# EAGLE design LPC2148 Engine Room ADUM (EAGLE 6.2)
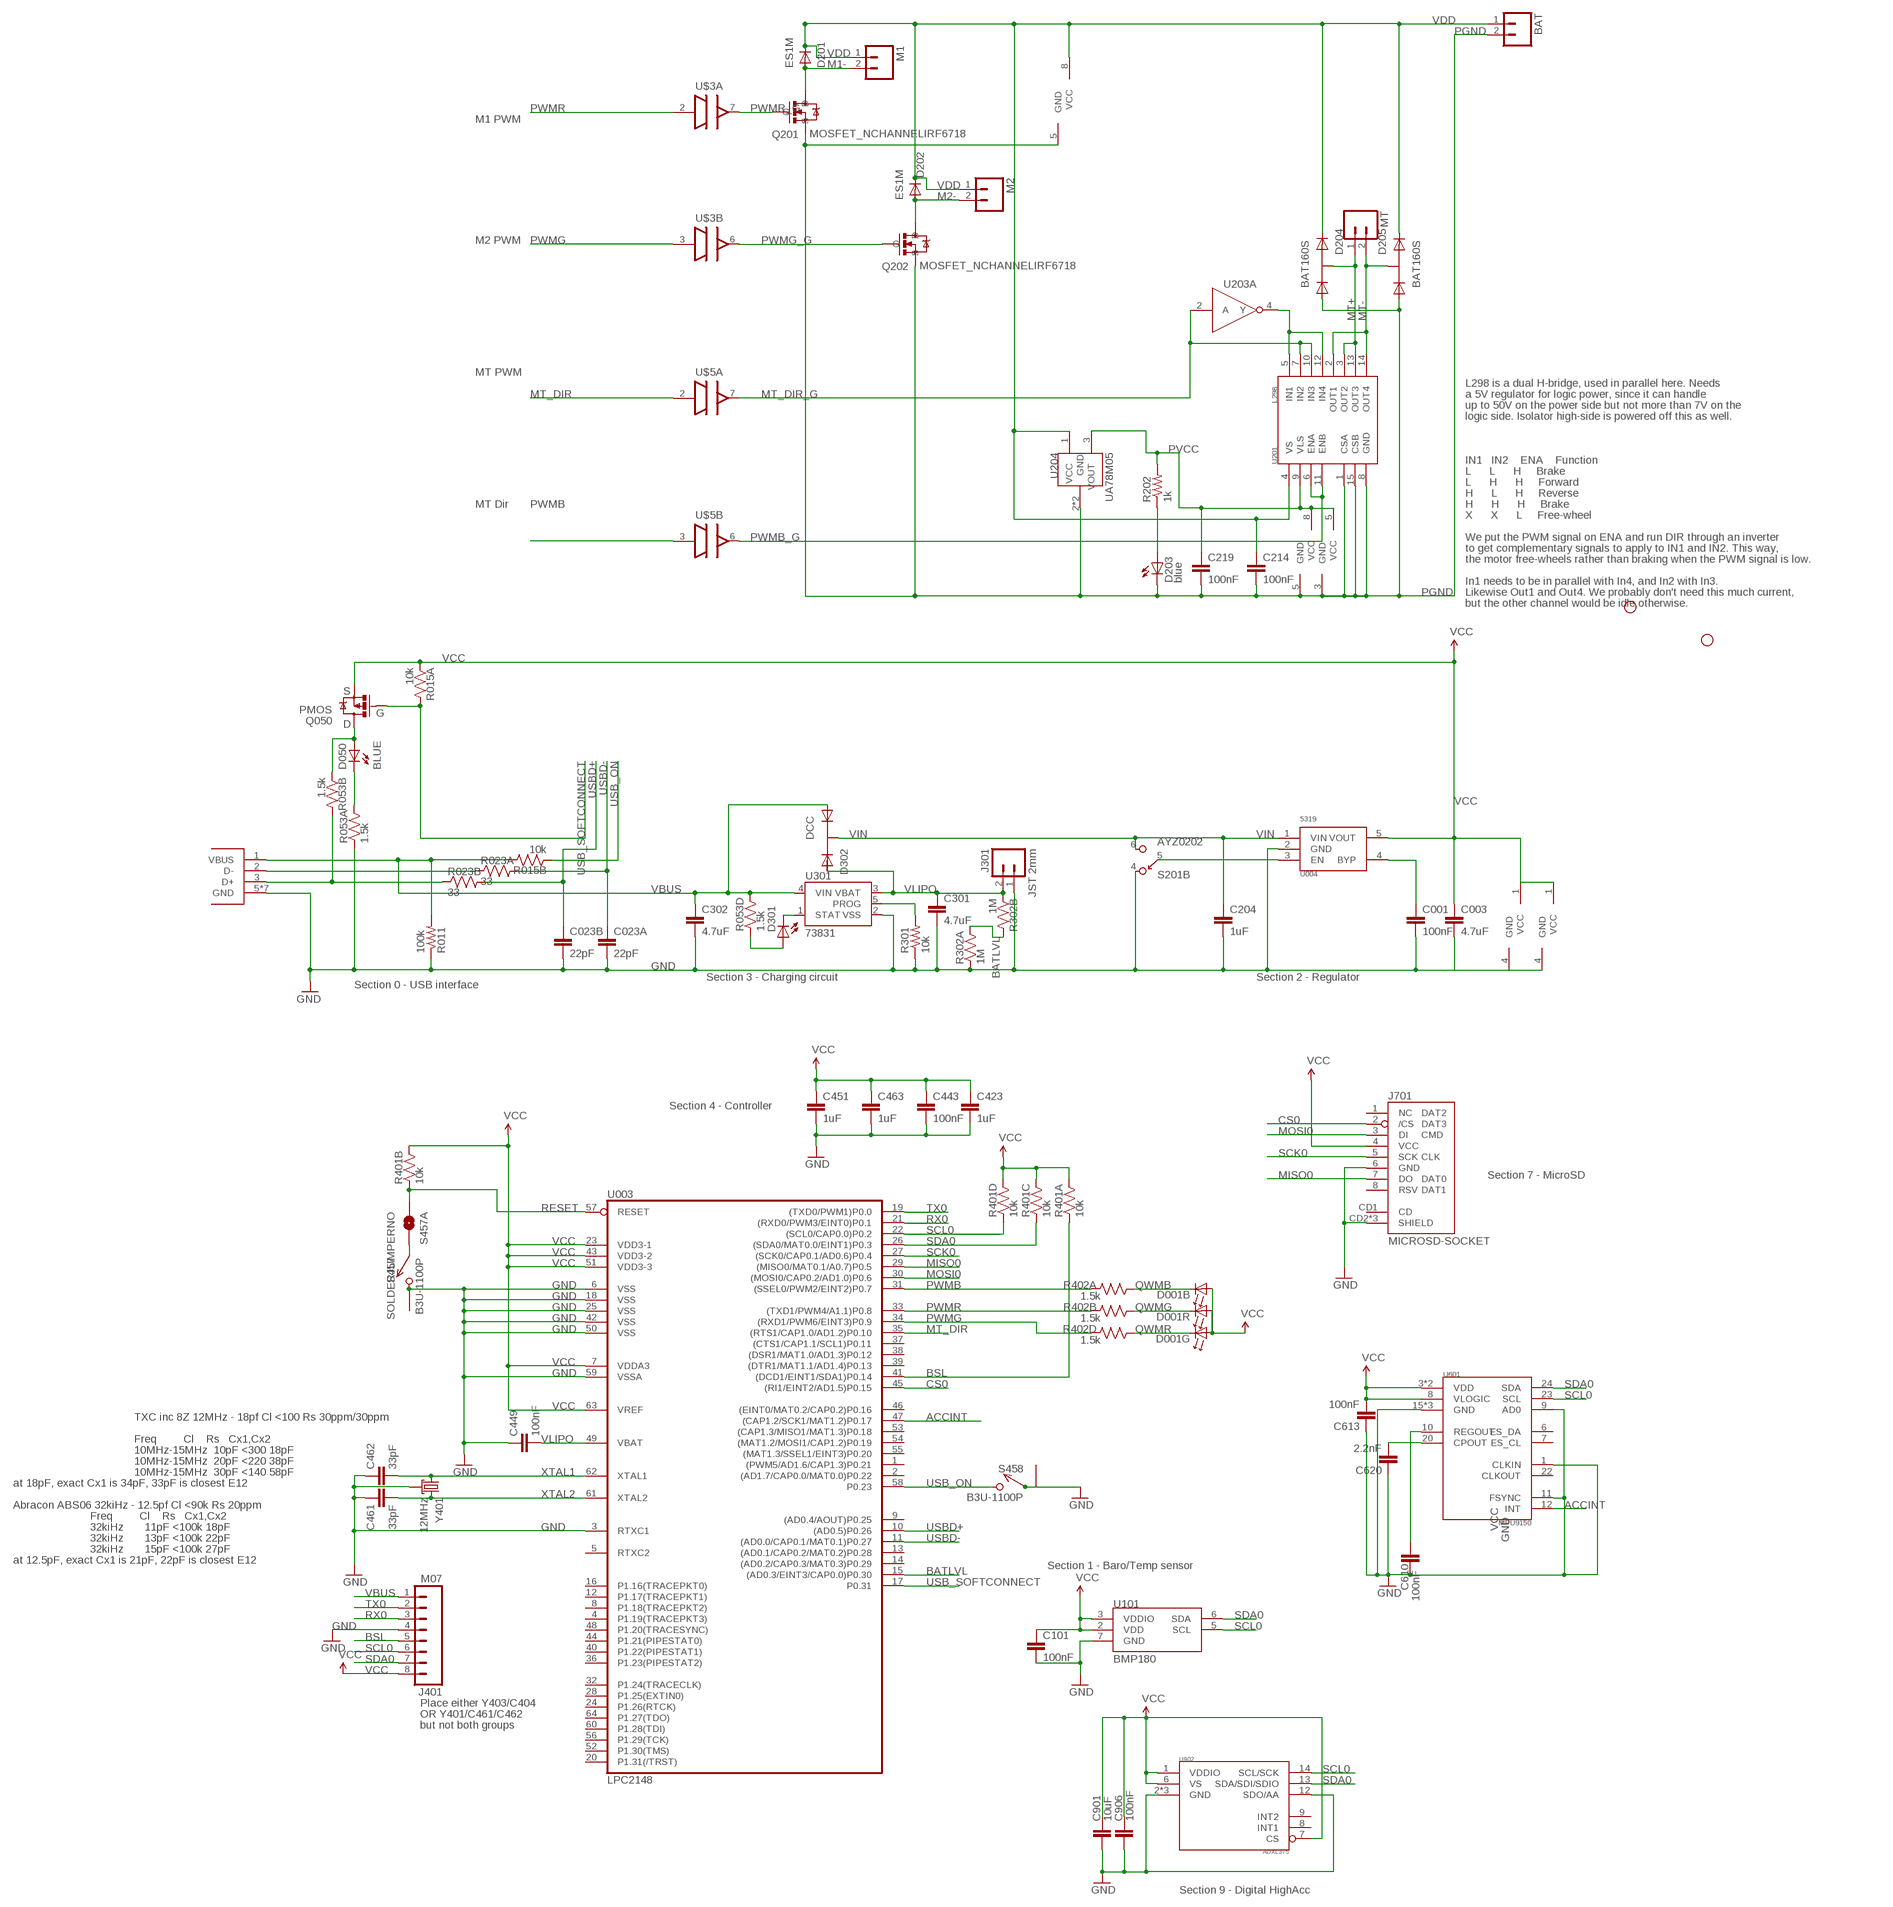
[diagram p0: schematic, sheet 1]

## Parts
BAT  M02PTH4  [1X02_XTRA_BIG]
C001  100nF  CAP0402-CAP  [0402-CAP]
C003  4.7uF  CAP0402-CAP  [0402-CAP]
C023  22pF  CKCM25  [CKCM25]
C101  100nF  CAP0402-CAP  [0402-CAP]
C204  1uF  CAP0402-CAP  [0402-CAP]
C214  100nF  CAP0402-CAP  [0402-CAP]
C219  100nF  CAP0402-CAP  [0402-CAP]
C301  4.7uF  CAP0402-CAP  [0402-CAP]
C302  4.7uF  CAP0402-CAP  [0402-CAP]
C423  1uF  CAP0402-CAP  [0402-CAP]
C443  100nF  CAP0402-CAP  [0402-CAP]
C449  100nF  CAP0402-CAP  [0402-CAP]
C451  1uF  CAP0402-CAP  [0402-CAP]
C461  33pF  CAP0402-CAP  [0402-CAP]
C462  33pF  CAP0402-CAP  [0402-CAP]
C463  1uF  CAP0402-CAP  [0402-CAP]
C610  100nF  CAP0402-CAP  [0402-CAP]
C613  100nF  CAP0402-CAP  [0402-CAP]
C620  2.2nF  CAP0402-CAP  [0402-CAP]
C901  10uF  CAP0603-CAP  [0603-CAP]
C906  100nF  CAP0402-CAP  [0402-CAP]
D001  SMLP36RGB2W(R)  [SMLP36]
D050  BLUE  LED0603  [LED-0603]
D201  ES1M  DIODE-DO-214AC  [DO-214AC]
D202  ES1M  DIODE-DO-214AC  [DO-214AC]
D203  blue  LED0603  [LED-0603]
D204  BAT160S  [SOT-223]
D205  BAT160S  [SOT-223]
D301  YELLOW  LED0603  [LED-0603]
D302  DCC  PMEG2005CT  [SOT-23-3]
J004  USB_MICROB_JSTGCT  [USB_MICROB_3075]
J301  JST 2mm  M02-JST-2MM-SMT  [JST-2-SMD]
J401  M07  M081X08  [1X08]
J701  MICROSD-SOCKET  [MICROSD-SOCKET-PP]
JP1  STAND-OFF  [STAND-OFF]
JP2  STAND-OFF  [STAND-OFF]
M1  M02PTH4  [1X02_XTRA_BIG]
M2  M02PTH4  [1X02_XTRA_BIG]
MT  M02PTH  [1X02]
Q050  PMOS  MOSFET-PCHANNELSMD  [SOT23-3]
Q201  MOSFET_NCHANNELIRF6718  [DIRECTFET_L6]
Q202  MOSFET_NCHANNELIRF6718  [DIRECTFET_L6]
R011  100k  RESISTOR0402-RES  [0402-RES]
R015  10k  RP2EXB24V  [CRA02]
R023  33  RP2EXB24V  [CRA02]
R053  1.5k  RP404  [CRA04]
R202  1k  RESISTOR0402-RES  [0402-RES]
R301  10k  RESISTOR0402-RES  [0402-RES]
R302  1M  RP2EXB24V  [CRA02]
R401  10k  RP404  [CRA04]
R402  1.5k  RP404  [CRA04]
S201  AYZ0202  [AYZ0202]
S457  B3U-1100P  [B3U-1100P]
S457A  SOLDERJUMPERNO  [SJ_2S-NO]
S458  B3U-1100P  [B3U-1100P]
U003  LPC2148  LPC213X  [SQFP-S-10X10-64]
U004  5319  MIC5319D5  [SOT-23-5]
U101  BMP180  [BMP180]
U201  L298  [MULTIWATT15]
U203  MC74VHC1G04  [SOT-23-5]
U204  UA78M05  [SOT-223]
U301  73831  MCP73831  [SOT23-5]
U601  MPU9150  [LLGA24]
U902  ADXL375  [ADXL375]
U$3  ADUM3221  [SO8N]
U$5  ADUM3221  [SO8N]
Y401  12MHz  CX2520  [CRYSTAL_SMD_2MM_2_5MM]

## Nets
ACCINT: U003.47((CAP1.2/SCK1/MAT1.2)P0.17) U601.12(INT)
BATLVL: R302.3 R302.4 U003.15((AD0.3/EINT3/CAP0.0)P0.30)
BSL: J401.5 R401.1 U003.41((DCD1/EINT1/SDA1)P0.14)
CONN_D+: J004.3(D+) R023.2 R053.7
CONN_D-: J004.2(D-) R023.1
CS0: J701.2(/CS) U003.45((RI1/EINT2/AD1.5)P0.15)
EN: S201.5 U004.3(EN)
GND [power]: C001.2 C003.2 C023.3 C023.4 C101.2 C204.2 C301.2 C302.2 C423.2 C443.2 C449.1 C451.2 C461.1 C462.1 C463.2 C610.2 C613.1 C620.1 C901.2 C906.2 J004.5(GND) J004.P$1(GND) J004.P$2(GND) J004.P$3(GND) J004.P$4(GND) J004.P$8(GND) J004.P$10(GND) J301.1 J401.4 J701.6(GND) J701.CD2(SHIELD) J701.GND1(SHIELD) J701.GND3(SHIELD) R011.1 R053.1 R301.1 R302.1 S201.4 S457.P$2 S457.P$3 S458.P$1 S458.P$3 U003.3(RTXC1) U003.6(VSS) U003.18(VSS) U003.25(VSS) U003.42(VSS) U003.50(VSS) U003.59(VSSA) U004.2(GND) U101.7(GND) U301.2(VSS) U601.1(CLKIN) U601.9(AD0) U601.11(FSYNC) U601.15(GND) U601.17(GND) U601.18(GND) U902.2(GND) U902.4(GND) U902.5(GND) U902.12(SDO/AA) U$3.4(INP:GND) U$5.4(INP:GND) Y401.2(GND) Y401.4(GND)
M1- [power]: D201.A M1.2 Q201.D1(D) Q201.D2(D)
M2- [power]: D202.A M2.2 Q202.D1(D) Q202.D2(D)
MISO0: J701.7(DO) U003.29((MISO0/MAT0.1/A0.7)P0.5)
MOSI0: J701.3(DI) U003.30((MOSI0/CAP0.2/AD1.0)P0.6)
MT+ [lt_power]: D204.4(K1A2) MT.1 U201.3(OUT2) U201.13(OUT3)
MT- [lt_power]: D205.4(K1A2) MT.2 U201.2(OUT1) U201.14(OUT4)
MT_DIR: U003.35((RTS1/CAP1.0/AD1.2)P0.10) U$5.2(A:IN)
MT_DIR_G: U201.7(IN2) U201.10(IN3) U203.2(A:A) U$5.7(A:OUT)
N$1: D203.A R202.1
N$2: U201.5(IN1) U201.12(IN4) U203.4(A:Y)
N$12: C620.2 U601.20(CPOUT)
N$13: C610.1 U601.10(REGOUT)
N$14 [power]: S457.P$1 S457A.2
N$15: R301.2 U301.5(PROG)
N$16: D050.C R053.8
N$17: C001.1 U004.4(BYP)
N$18: D301.A R053.4
N$19: D301.C U301.1(STAT)
N$20: D050.A Q050.3(D) R053.2
PGND [power]: BAT.2 C214.2 C219.2 D203.C D204.1(A1) D205.1(A1) Q201.S Q202.S U201.1(CSA) U201.8(GND) U201.15(CSB) U203.3(PWR:GND) U204.2(GND) U204.4(GND) U$3.5(OUTP:GND) U$5.5(OUTP:GND)
PVCC: C219.1 R202.2 U201.9(VLS) U203.5(PWR:VCC) U204.3(VOUT) U$5.8(OUTP:VCC)
PWMB: R402.8 U003.31((SSEL0/PWM2/EINT2)P0.7) U$5.3(B:IN)
PWMB_G: U201.6(ENA) U201.11(ENB) U$5.6(B:OUT)
PWMG: R402.5 U003.34((RXD1/PWM6/EINT3)P0.9) U$3.3(B:IN)
PWMG_G: Q202.G U$3.6(B:OUT)
PWMR: R402.7 U003.33((TXD1/PWM4/A1.1)P0.8) U$3.2(A:IN)
PWMR_G: Q201.G U$3.7(A:OUT)
QWMB: D001.1(B:C) R402.1
QWMG: D001.5(G:C) R402.4
QWMR: D001.3(R:C) R402.2
RESET: R401.2 S457A.1 U003.57(RESET)
RX0: J401.3 U003.21((RXD0/PWM3/EINT0)P0.1)
SCK0: J701.5(SCK) U003.27((SCK0/CAP0.1/AD0.6)P0.4)
SCL0: J401.6 R401.4 U003.22((SCL0/CAP0.0)P0.2) U101.5(SCL) U601.23(SCL) U902.14(SCL/SCK)
SDA0: J401.7 R401.3 U003.26((SDA0/MAT0.0/EINT1)P0.3) U101.6(SDA) U601.24(SDA) U902.13(SDA/SDI/SDIO)
TX0: J401.2 U003.19((TXD0/PWM1)P0.0)
USB_ON: R015.2 S458.P$2 U003.58(P0.23)
USB_SOFTCONNECT: Q050.1(G) R015.4 U003.17(P0.31)
USBD+: C023.2 R023.3 U003.10((AD0.5)P0.26)
USBD-: C023.1 R023.4 U003.11((AD0.0/CAP0.1/MAT0.1)P0.27)
VBUS [power]: C302.1 D302.1(A1) J004.1(VBUS) J401.1 R011.2 R015.3 R053.5 U301.4(VIN)
VCC [power]: C003.1 C101.1 C423.1 C443.1 C451.1 C463.1 C613.2 C901.1 C906.1 D001.2(B:A) D001.4(R:A) D001.6(G:A) J401.8 J701.4(VCC) Q050.2(S) R015.1 R401.5 R401.6 R401.7 R401.8 U003.7(VDDA3) U003.23(VDD3-1) U003.43(VDD3-2) U003.51(VDD3-3) U003.63(VREF) U004.5(VOUT) U101.2(VDD) U101.3(VDDIO) U601.3(VDD) U601.8(VLOGIC) U601.13(VDD) U902.1(VDDIO) U902.6(VS) U902.7(CS) U$3.1(INP:VCC) U$5.1(INP:VCC)
VDD [power]: BAT.1 C214.1 D201.C D202.C D204.3(K2) D205.3(K2) M1.1 M2.1 U201.4(VS) U204.1(VCC) U$3.8(OUTP:VCC)
VIN: C204.1 D302.3(K) S201.6 U004.1(VIN)
VLIPO [power]: C301.1 C449.2 D302.2(A2) J301.2 R302.2 U003.49(VBAT) U301.3(VBAT)
XTAL1: C462.2 U003.62(XTAL1) Y401.1
XTAL2: C461.2 U003.61(XTAL2) Y401.3
Unconnected: J701.1(NC) J701.8(RSV) J701.CD1(CD) R053.3 R053.6 R402.3 R402.6 S201.1 S201.2 S201.3 U003.1((PWM5/AD1.6/CAP1.3)P0.21) U003.2((AD1.7/CAP0.0/MAT0.0)P0.22) U003.4(P1.19(TRACEPKT3)) U003.5(RTXC2) U003.8(P1.18(TRACEPKT2)) U003.9((AD0.4/AOUT)P0.25) U003.12(P1.17(TRACEPKT1)) U003.13((AD0.1/CAP0.2/MAT0.2)P0.28) U003.14((AD0.2/CAP0.3/MAT0.3)P0.29) U003.16(P1.16(TRACEPKT0)) U003.20(P1.31(/TRST)) U003.24(P1.26(RTCK)) U003.28(P1.25(EXTIN0)) U003.32(P1.24(TRACECLK)) U003.36(P1.23(PIPESTAT2)) U003.37((CTS1/CAP1.1/SCL1)P0.11) U003.38((DSR1/MAT1.0/AD1.3)P0.12) U003.39((DTR1/MAT1.1/AD1.4)P0.13) U003.40(P1.22(PIPESTAT1)) U003.44(P1.21(PIPESTAT0)) U003.46((EINT0/MAT0.2/CAP0.2)P0.16) U003.48(P1.20(TRACESYNC)) U003.52(P1.30(TMS)) U003.53((CAP1.3/MISO1/MAT1.3)P0.18) U003.54((MAT1.2/MOSI1/CAP1.2)P0.19) U003.55((MAT1.3/SSEL1/EINT3)P0.20) U003.56(P1.29(TCK)) U003.60(P1.28(TDI)) U003.64(P1.27(TDO)) U601.6(ES_DA) U601.7(ES_CL) U601.22(CLKOUT) U902.8(INT1) U902.9(INT2)

## Notes on the sheet
- M1 PWM
- M2 PWM
- MT PWM
- L298 is a dual H-bridge, used in parallel here. Needs
- a 5V regulator for logic power, since it can handle
- up to 50V on the power side but not more than 7V on the
- logic side. Isolator high-side is powered off this as well.
- IN1   IN2    ENA    Function
- L      L      H     Brake
- L      H      H     Forward
- H      L      H     Reverse
- MT Dir | H      H      H     Brake
- X      X      L     Free-wheel
- We put the PWM signal on ENA and run DIR through an inverter
- to get complementary signals to apply to IN1 and IN2. This way,
- the motor free-wheels rather than braking when the PWM signal is low.
- In1 needs to be in parallel with In4, and In2 with In3.
- Likewise Out1 and Out4. We probably don't need this much current,
- but the other channel would be idle otherwise.
- S
- G
- D
- Section 0 - USB interface | Section 3 - Charging circuit | Section 2 - Regulator
- Section 4 - Controller
- Section 7 - MicroSD
- TXC inc 8Z 12MHz - 18pf Cl <100 Rs 30ppm/30ppm
- Freq         Cl    Rs   Cx1,Cx2
- 10MHz-15MHz  10pF <300 18pF
- 10MHz-15MHz  20pF <220 38pF
- 10MHz-15MHz  30pF <140 58pF
- at 18pF, exact Cx1 is 34pF, 33pF is closest E12
- Abracon ABS06 32kiHz - 12.5pf Cl <90k Rs 20ppm
- Freq         Cl    Rs   Cx1,Cx2
- 32kiHz       11pF <100k 18pF
- 32kiHz       13pF <100k 22pF
- 32kiHz       15pF <100k 27pF
- at 12.5pF, exact Cx1 is 21pF, 22pF is closest E12
- Section 1 - Baro/Temp sensor
- Place either Y403/C404
- OR Y401/C461/C462
- but not both groups
- Section 9 - Digital HighAcc

## Library data of the parts
BAT M1 M2 MT = SparkFun:M02: Header 2 Standard 2-pin 0.1" header. Use with straight break away headers (SKU : PRT-00116), right angle break away headers (PRT-00553), swiss pins (PRT-00743), machine pins (PRT-00117), and female headers (PRT-00115). Molex polarized connector foot print use with SKU : PRT-08233 with associated crimp pins and housings.
C001 C101 C443 C449 C610 C613 = SparkFun:CAP: Capacitor Standard 0603 ceramic capacitor, and 0.1" leaded capacitor.; DIGIKEY: 445-1265-1-ND
C003 C301 C302 = SparkFun:CAP: Capacitor Standard 0603 ceramic capacitor, and 0.1" leaded capacitor.; DIGIKEY: 445-7395-1-ND
C023 = KwanSystems:CKC; DIGIKEY: 445-1860-1-ND
C204 C423 C451 C463 = SparkFun:CAP: Capacitor Standard 0603 ceramic capacitor, and 0.1" leaded capacitor.; DIGIKEY: 445-4114-1-ND
C214 C219 = SparkFun:CAP: Capacitor Standard 0603 ceramic capacitor, and 0.1" leaded capacitor.
C461 C462 = SparkFun:CAP: Capacitor Standard 0603 ceramic capacitor, and 0.1" leaded capacitor.; DIGIKEY: 445-1241-1-ND
C620 = SparkFun:CAP: Capacitor Standard 0603 ceramic capacitor, and 0.1" leaded capacitor.; DIGIKEY: 445-1257-1-ND
C901 = SparkFun:CAP: Capacitor Standard 0603 ceramic capacitor, and 0.1" leaded capacitor.; DIGIKEY: 445-7486-1-ND
C906 = SparkFun-Passives:CAP: Capacitor Standard 0603 ceramic capacitor, and 0.1" leaded capacitor.; DIGIKEY: 445-1265-1-ND
D001 = KwanSystems:SMLP36RGB2W(R); DIGIKEY: 846-1097-1-ND
D050 = SparkFun:LED: LEDs Standard schematic elements and footprints for 5mm, 3mm, 1206, and 0603 sized LEDs. 5mm - Spark Fun Electronics SKU : COM-00529 (and others); DIGIKEY: 350-2037-1-ND
D201 D202 = diode:DIODE-: DIODE
D203 = SparkFun:LED: LEDs Standard schematic elements and footprints for 5mm, 3mm, 1206, and 0603 sized LEDs. 5mm - Spark Fun Electronics SKU : COM-00529 (and others)
D204 D205 = KwanSystems:BAT160S
D301 = SparkFun:LED: LEDs Standard schematic elements and footprints for 5mm, 3mm, 1206, and 0603 sized LEDs. 5mm - Spark Fun Electronics SKU : COM-00529 (and others); DIGIKEY: 350-2032-1-ND
D302 = KwanSystems:PMEG2005CT; DIGIKEY: 568-6500-1-ND
J004 = KwanSystems:USB_MICROB_JST; DIGIKEY: 609-4616-2-ND
J301 = SparkFun:M02: Header 2 Standard 2-pin 0.1" header. Use with straight break away headers (SKU : PRT-00116), right angle break away headers (PRT-00553), swiss pins (PRT-00743), machine pins (PRT-00117), and female headers (PRT-00115). Molex polarized connector foot print use with SKU : PRT-08233 with associated crimp pins and housings.; DIGIKEY: 455-1749-1-ND
J401 = SparkFun-Connectors:M08: Header 8 Standard 8-pin 0.1" header. Use with straight break away headers (SKU : PRT-00116), right angle break away headers (PRT-00553), swiss pins (PRT-00743), machine pins (PRT-00117), and female headers (PRT-00115).; DIGIKEY: $NOPART
J701 = KwanSystems:MICROSD-SOCKET: microSD Socket Push-push type uSD socket. Digikey 101-00660-68-6-1-ND. tDoc lines correctly indicate media card edge positions when inserting (unlocked, locked, depressed).; DIGIKEY: 101-00581-59-1-ND
JP1 JP2 = SparkFun:STAND-OFF: Stand Off This is the mechanical footprint for a #4 phillips button head screw. Use the keepout ring to avoid running the screw head into surrounding components. SKU : PRT-00447
Q050 = SparkFun:MOSFET-PCHANNEL; DIGIKEY: NTR1P02T1GOSCT-ND
Q201 Q202 = KwanSystems:MOSFET_NCHANNEL
R011 = SparkFun:RESISTOR: Resistor Basic schematic elements and footprints for 0603, 1206, and PTH resistors.; DIGIKEY: P100KLCT-ND
R015 = KwanSystems:RP2; DIGIKEY: Y5103CT-ND
R023 R302 = KwanSystems:RP2
R053 R402 = KwanSystems:RP4; DIGIKEY: CRA4S81.5KCT-ND
R202 = SparkFun:RESISTOR: Resistor Basic schematic elements and footprints for 0603, 1206, and PTH resistors.
R301 = SparkFun:RESISTOR: Resistor Basic schematic elements and footprints for 0603, 1206, and PTH resistors.; DIGIKEY: P10.0KLCT-ND
R401 = KwanSystems:RP4; DIGIKEY: CRA4S810KCT-ND
S201 = KwanSystems:AYZ0202; DIGIKEY: 401-2013-1-ND
S457 S458 = KwanSystems:B3U-1100P; DIGIKEY: SW1021CT-ND
S457A = SparkFun-Passives:SOLDERJUMPER: Solder Jumper Standard SMD solder jumper. Used to automate production. Two varients : Normally Open and Normally Closed are the same, but have different paste layers. NC will have a large amount of paste and should jumper during reflow.; DIGIKEY: $NOPART
U003 = SparkFun:LPC213X: LPC213x Schematic element and footprint for NXP LPC213x. Spark Fun Electronics SKU : COM-00520; DIGIKEY: 568-1765-ND
U004 = KwanSystems:MIC5319; DIGIKEY: 576-1910-1-ND
U101 = KwanSystems:BMP180; DIGIKEY: 828-1027-1-ND
U201 = SparkFun:L298: L298 Dual Full Bridge Driver
U203 = KwanSystems:MC74VHC1G04
U204 = KwanSystems:UA78M05
U301 = SparkFun:MCP73831: Microchip's MCP73831 Miniature single cell, fully integrated Li-Ion, Li-polymer charge management controller http://ww1.microchip.com/downloads/en/DeviceDoc/21984a.pdf; DIGIKEY: MCP73831T-2ACI/OTCT-ND
U601 = KwanSystems:MPU9150; DIGIKEY: $NOPART
U902 = KwanSystems:ADXL375; DIGIKEY: ADXL375BCCZ-ND
U$3 U$5 = KwanSystems:ADUM3221
Y401 = KwanSystems:CX2520; DIGIKEY: 887-1487-1-ND

## Net classes
0 default: width 0.152 mm, drill 0.33 mm, clearance 0.152 mm
1 power: width 0.152 mm, drill 0.33 mm, clearance 0.152 mm to class 0, clearance 0.152 mm
2 lt_power: width 0.152 mm, drill 0.33 mm, clearance 0.254 mm to class 0, clearance 0.254 mm to class 1, clearance 0.254 mm

## Board
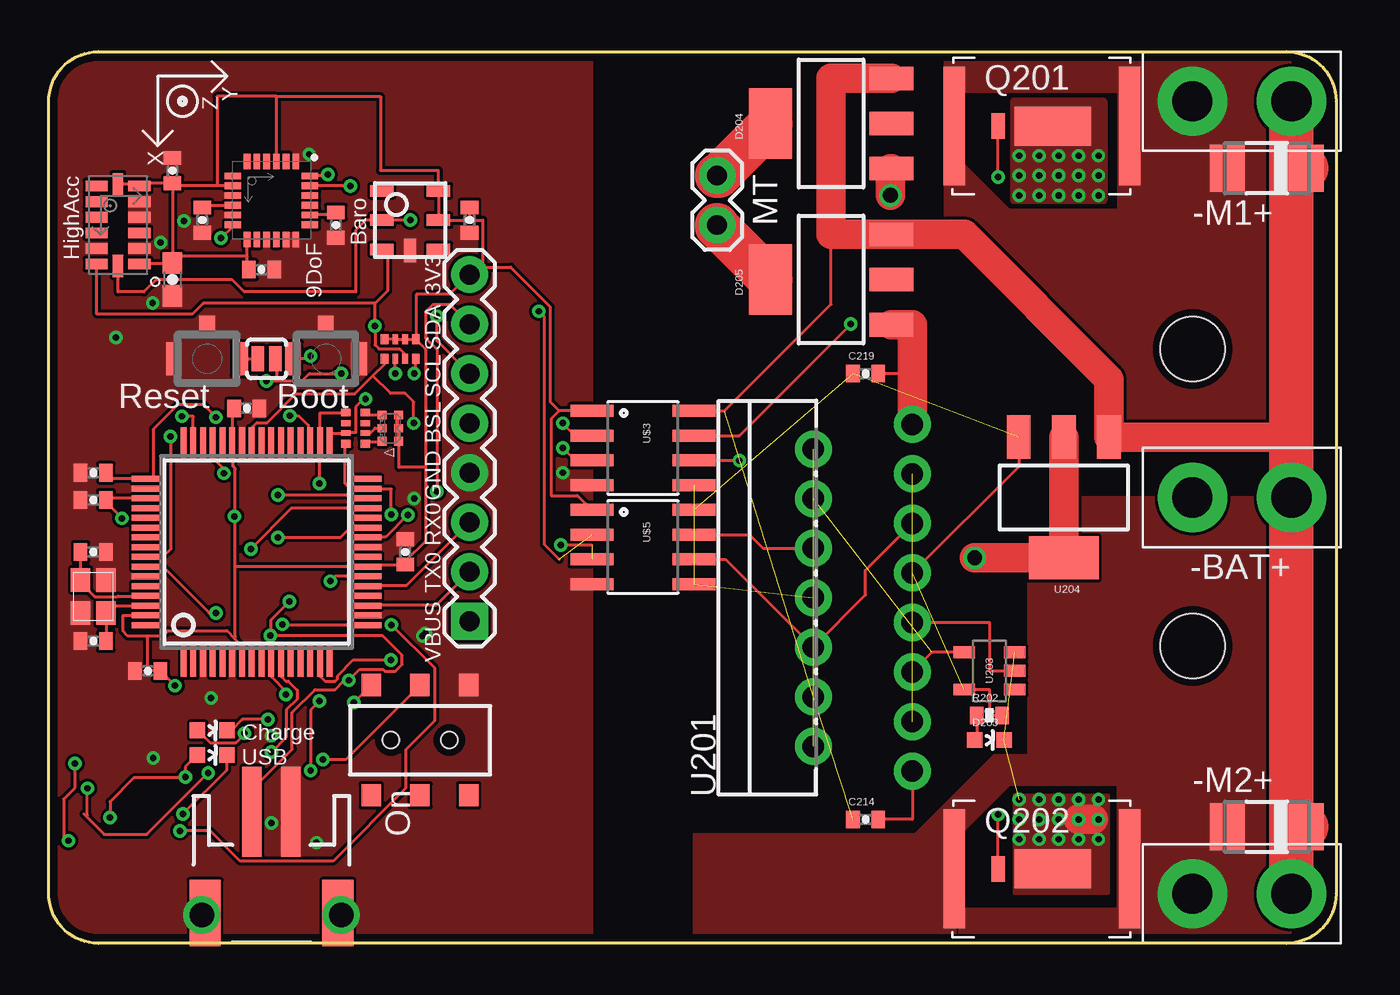
[diagram p1: board, top side]
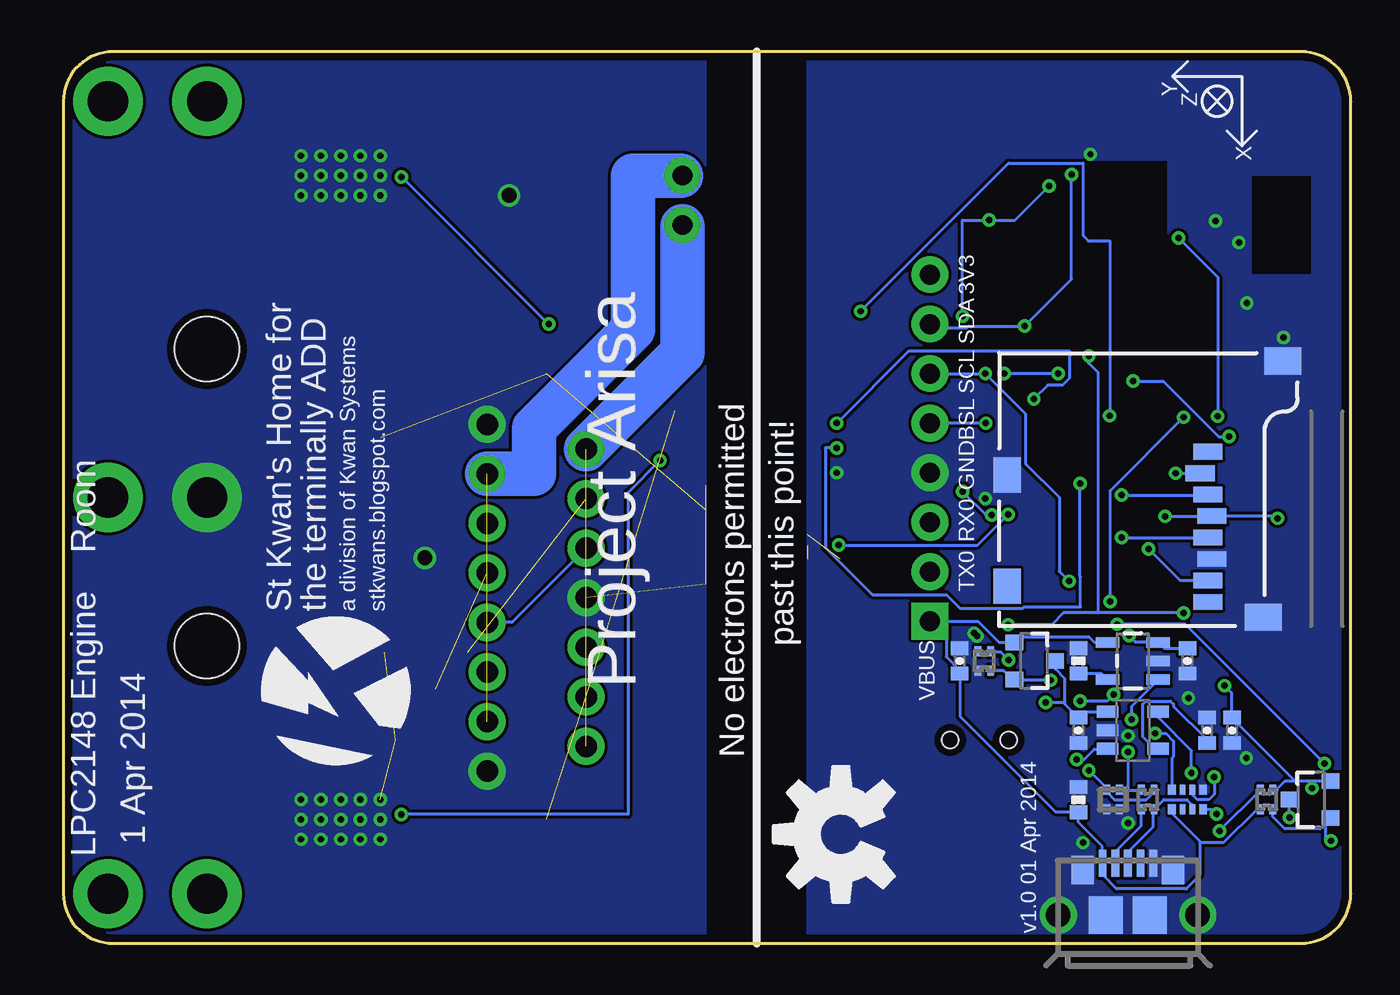
[diagram p2: board, bottom side, seen from below]

Size 66.04 x 45.72 mm. Coordinates in mm from the lower left corner, seen from the top.
Outline: 2.54,45.72 63.5,45.72 arc-90 66.04,43.18 66.04,2.54 arc-90 63.5,0 2.54,0 arc-90 0,2.54 0,43.18 arc-90 2.54,45.72
Copper layers (1*16): Top 0.0356mm / dielectric 1.5011mm / Bottom 0.0356mm
Design rules: minimum track width 6mil, minimum drill 13mil, track to track 6mil, track to pad 6mil, pad to pad 6mil, via to via 6mil, smd to smd 6mil, copper to edge 15mil, drill to drill 6mil, minimum pad ring 7mil, minimum via ring 7mil, stop-mask expansion 4mil, vias tented up to drill 21mil, thermal gap 10mil
tRestrict: area 27.9,0 to 33,45.7
bRestrict: area 27.9,0 to 33,45.7

### Footprints (pad centres in the part's own frame; a part is rotated, then mirrored left to right if it is on the bottom)
1X02_XTRA_BIG = drill 2.057 pad 3.556: 1 -2.54,0; 2 2.54,0
0402-CAP = smd 0.7 x 0.9: 1 -0.65,0; 2 0.65,0
CKCM25 = smd 0.35 x 0.5: 1 -0.325,-0.5; 2 0.325,-0.5; 3 0.325,0.5; 4 -0.325,0.5
0603-CAP = smd 1.1 x 1: 1 -0.85,0; 2 0.85,0
SMLP36 = smd 0.45 x 0.45: 1 -0.675,0.425; 2 -0.675,-0.425; 5 0.675,0.425; 6 0.675,-0.425 | smd 0.4 x 0.45: 3 0,0.425; 4 0,-0.425
LED-0603 = smd 0.8 x 0.8: A 0,-0.75; C 0,0.75
DO-214AC = smd 1.8 x 2.4: A 2.025,0; C -2.025,0
SOT-223 = smd 1.219 x 2.235: 1 -2.311,-3.099; 2 0,-3.099; 3 2.311,-3.099 | smd 3.6 x 2.2: 4 0,3.099
SOT-23-3 = smd 0.9 x 0.8: 1 -1,0.95; 2 -1,-0.95; 3 1.1,0
USB_MICROB_3075 = smd 0.4 x 1.4: 1 -1.3,4.1; 2 -0.65,4.1; 3 0,4.1; 4 0.65,4.1; 5 1.3,4.1 | smd 1.15 x 1.45: P$1 2.32,3.75; P$10 -2.32,3.75 | smd 1.75 x 1.9: P$2 1.125,1.45; P$8 -1.125,1.45 | drill 1.25 pad 1.9: P$3 -3.575,1.45; P$4 3.575,1.45
JST-2-SMD = smd 1 x 4.6: 1 -1,-3.7; 2 1,-3.7 | smd 1.6 x 3.4: NC1 -3.4,1.5; NC2 3.4,1.5
1X08 = drill 1.016 pad 1.88 square: 1 0,0 | drill 1.016 pad 1.88: 2 2.54,0; 3 5.08,0; 4 7.62,0; 5 10.16,0; 6 12.7,0; 7 15.24,0; 8 17.78,0
MICROSD-SOCKET-PP = smd 0.8 x 1.5: 1 -8.94,10.7; 2 -7.84,10.3; 3 -6.74,10.7; 4 -5.64,10.9; 5 -4.54,10.7; 6 -3.44,10.9; 7 -2.34,10.7; 8 -1.24,10.7 | smd 1.8 x 1.4: CD1 -2.05,0.4; CD2 -7.75,0.4 | smd 1.4 x 1.9: GND1 -13.6,14.55; GND3 -0.45,13.55
STAND-OFF = hole 3.302: 0,0
1X02 = drill 1.016 pad 1.88: 1 0,0; 2 2.54,0
SOT23-3 = smd 0.8 x 0.9: 1 -0.95,-1; 2 0.95,-1; 3 0,1.1
DIRECTFET_L6 = smd 1.1 x 6.1: D1 -4.35,0; D2 4.65,0 | smd 0.7 x 1.3: G -2.1,0 | smd 3.9 x 2: S 0.7,0
0402-RES = smd 0.7 x 0.9: 1 -0.65,0; 2 0.65,0
CRA02 = smd 0.35 x 0.5: 1 -0.325,-0.5; 2 0.325,-0.5; 3 0.325,0.5; 4 -0.325,0.5
CRA04 = smd 0.4 x 0.5: 1 -0.8,-0.5; 4 0.8,-0.5; 5 0.8,0.5; 8 -0.8,0.5 | smd 0.3 x 0.5: 2 -0.25,-0.5; 3 0.25,-0.5; 6 0.25,0.5; 7 -0.25,0.5
AYZ0202 = smd 1 x 1.15: 1 -2.5,2.825; 2 0,2.825; 3 2.5,2.825; 4 -2.5,-2.825; 5 0,-2.825; 6 2.5,-2.825 | hole 0.85: 1.5,0; -1.5,0
B3U-1100P = smd 0.8 x 1.7: P$1 -1.7,0; P$2 1.7,0 | smd 0.8 x 1.1: P$3 0,-1.65
SJ_2S-NO = smd 0.635 x 1.27: 1 -0.45,0; 2 0.45,0
SQFP-S-10X10-64 = smd 0.3 x 1.6: 1 -3.75,-5.6; 2 -3.25,-5.6; 3 -2.75,-5.6; 4 -2.25,-5.6; 5 -1.75,-5.6; 6 -1.25,-5.6; 7 -0.75,-5.6; 8 -0.25,-5.6; 9 0.25,-5.6; 10 0.75,-5.6; 11 1.25,-5.6; 12 1.75,-5.6; 13 2.25,-5.6; 14 2.75,-5.6; 15 3.25,-5.6; 16 3.75,-5.6; 33 3.75,5.6; 34 3.25,5.6; 35 2.75,5.6; 36 2.25,5.6; 37 1.75,5.6; 38 1.25,5.6; 39 0.75,5.6; 40 0.25,5.6; 41 -0.25,5.6; 42 -0.75,5.6; 43 -1.25,5.6; 44 -1.75,5.6; 45 -2.25,5.6; 46 -2.75,5.6; 47 -3.25,5.6; 48 -3.75,5.6 | smd 1.6 x 0.3: 17 5.6,-3.75; 18 5.6,-3.25; 19 5.6,-2.75; 20 5.6,-2.25; 21 5.6,-1.75; 22 5.6,-1.25; 23 5.6,-0.75; 24 5.6,-0.25; 25 5.6,0.25; 26 5.6,0.75; 27 5.6,1.25; 28 5.6,1.75; 29 5.6,2.25; 30 5.6,2.75; 31 5.6,3.25; 32 5.6,3.75; 49 -5.6,3.75; 50 -5.6,3.25; 51 -5.6,2.75; 52 -5.6,2.25; 53 -5.6,1.75; 54 -5.6,1.25; 55 -5.6,0.75; 56 -5.6,0.25; 57 -5.6,-0.25; 58 -5.6,-0.75; 59 -5.6,-1.25; 60 -5.6,-1.75; 61 -5.6,-2.25; 62 -5.6,-2.75; 63 -5.6,-3.25; 64 -5.6,-3.75
SOT-23-5 = smd 0.6 x 1.1: 1 -0.95,-1.3; 2 0,-1.3; 3 0.95,-1.3; 4 0.95,1.3; 5 -0.95,1.3
BMP180 = smd 0.6 x 1.2: 1 1.5,1.45; 2 0,1.45; 3 -1.5,1.45; 4 -1.5,-1.45; 5 0,-1.45; 6 1.5,-1.45 | smd 1.2 x 0.6: 7 1.55,0
MULTIWATT15 = drill 1.1 pad 1.9: 1 -8.95,-2.39; 2 -7.68,2.69; 3 -6.41,-2.39; 4 -5.14,2.69; 5 -3.87,-2.39; 6 -2.6,2.69; 7 -1.33,-2.39; 8 -0.06,2.69; 9 1.21,-2.39; 10 2.48,2.69; 11 3.75,-2.39; 12 5.02,2.69; 13 6.29,-2.39; 14 7.56,2.69; 15 8.83,-2.39
SOT23-5 = smd 0.55 x 1.2: 1 -0.95,-1.3; 2 0,-1.3; 3 0.95,-1.3; 4 0.95,1.3; 5 -0.95,1.3
LLGA24 = smd 0.8 x 0.35: 1 -2,1.25; 2 -2,0.75; 3 -2,0.25; 4 -2,-0.25; 5 -2,-0.75; 6 -2,-1.25; 13 2,-1.25; 14 2,-0.75; 15 2,-0.25; 16 2,0.25; 17 2,0.75; 18 2,1.25 | smd 0.35 x 0.85: 7 -1.25,-1.975; 8 -0.75,-1.975; 9 -0.25,-1.975; 10 0.25,-1.975; 11 0.75,-1.975; 12 1.25,-1.975; 19 1.25,1.975; 20 0.75,1.975; 21 0.25,1.975; 22 -0.25,1.975; 23 -0.75,1.975; 24 -1.25,1.975
ADXL375 = smd 0.55 x 1.145: 1 2,1.097; 2 1.2,1.097; 3 0.4,1.097; 4 -0.4,1.097; 5 -1.2,1.097; 6 -2,1.097; 8 -2,-1.097; 9 -1.2,-1.097; 10 -0.4,-1.097; 11 0.4,-1.097; 12 1.2,-1.097; 13 2,-1.097 | smd 1.145 x 0.55: 7 -2.098,0; 14 2.098,0
SO8N = smd 0.61 x 2.21: 1 -1.905,-2.616; 2 -0.635,-2.616; 3 0.635,-2.616; 4 1.905,-2.616; 5 1.905,2.616; 6 0.635,2.616; 7 -0.635,2.616; 8 -1.905,2.616
CRYSTAL_SMD_2MM_2_5MM = smd 1.2 x 1: 1 -0.85,-0.65; 2 0.85,-0.65; 3 0.85,0.65; 4 -0.85,0.65

### Placement (x,y rotation side)
BAT  61.21,22.86 180 top
C001  7.37,10.92 90 bottom
C003  6.1,10.92 270 bottom
C023  12.19,7.37 180 bottom
C101  21.59,37.08 270 top
C204  13.97,10.92 270 bottom
C214  41.91,6.35 0 top
C219  41.91,29.21 0 top
C301  8.38,14.48 270 bottom
C302  20.07,14.48 90 bottom
C423  18.29,20.07 90 top
C443  10.16,27.43 0 top
C449  2.29,24.13 0 top
C451  2.29,22.73 180 top
C461  2.29,20.07 180 top
C462  2.29,15.49 0 top
C463  5.08,13.97 180 top
C610  7.87,37.08 270 top
C613  10.92,34.54 180 top
C620  14.73,36.83 90 top
C901  6.35,34.04 270 top
C906  6.35,39.62 90 top
D001  17.53,26.42 90 top
D050  8.38,9.65 270 top
D201  62.48,39.75 180 top
D202  62.48,5.97 180 top
D203  48.26,10.41 270 top
D204  40.13,42.04 90 top
D205  40.13,34.04 90 top
D301  8.38,10.92 270 top
D302  16.26,14.48 0 bottom
J004  11.43,0 0 bottom
J301  11.43,3.05 180 top
J401  21.59,16.51 90 top
J701  18.03,16.26 270 bottom
JP1  58.67,15.24 0 top
JP2  58.67,30.48 90 top
M1  61.21,43.18 180 top
M2  61.21,2.54 180 top
MT  34.29,39.37 270 top
Q050  2.03,7.37 90 bottom
Q201  50.8,41.91 0 top
Q202  50.8,3.81 0 top
R011  13.97,7.37 270 bottom
R015  4.32,7.37 180 bottom
R023  10.41,7.37 0 bottom
R053  8.38,7.37 180 bottom
R202  48.26,11.68 0 top
R301  13.97,14.48 270 bottom
R302  18.8,14.48 0 bottom
R401  18.03,30.48 0 top
R402  15.75,26.42 90 top
S201  19.05,10.41 180 top
S457  8.13,29.97 180 top
S457A  11.18,29.97 180 top
S458  14.22,29.97 180 top
U003  10.67,20.07 0 top
U004  11.18,10.92 270 bottom
U101  18.54,37.08 270 top
U201  41.91,17.78 90 top
U203  48.26,13.97 90 top
U204  52.07,22.86 180 top
U301  11.18,14.48 90 bottom
U601  11.43,38.1 270 top
U902  3.56,36.83 270 top
U$1  [KWAN_CIRCLE]  52.07,12.95 90 bottom
U$2  [OSHW-LOGO-L]  26.16,5.59 90 bottom
U$3  30.48,25.4 270 top
U$4  [AXES]  5.59,44.45 270 top
U$5  30.48,20.32 270 top
Y401  2.29,17.78 90 top

### Tracks (layer width: path | path; a pad name or v marks a point on that pad's centre or on a via)
ACCINT  (via drill 0.33)
  Top 0.152: v8.84,36.17 9.45,36.78 9.45,36.83 U601.12 | U003.47 7.42,27.03 v6.83,27.03
  Bottom 0.152: v8.84,36.17 6.83,34.16 v6.83,27.03
BATLVL  (via drill 0.33)
  Top 0.152: v17.55,14.53 15.62,14.53 14.81,13.72 14.81,13.56 14.68,13.44 14.17,13.44 13.92,13.69 13.92,14.45 U003.15
  Bottom 0.152: R302.4 19.1,14.96 18.49,14.96 R302.3 18.41,14.94 17.96,14.94 v17.55,14.53
BSL  (via drill 0.33)
  Top 0.152: 16.62,29.1 15.7,28.17 12.68,28.17 11.2,26.7 10.67,26.7 10.44,26.47 10.44,25.68 U003.41 | 16.62,29.1 17.22,29.69 R401.1 | v18.72,26.67 18.72,27.76 18.29,28.19 17.53,28.19 16.62,29.1
  Bottom 0.152: v18.72,26.67 J401.5
CONN_D+
  Bottom 0.152: R053.7 8.15,6.88 8.15,7.11 8.41,7.37 9.6,7.37 10.08,6.88 R023.2 10.13,6.81 10.13,5.97 11.43,4.67 J004.3
CONN_D-
  Bottom 0.152: R023.1 10.74,6.86 10.74,6.02 12.06,4.7 12.06,4.12 J004.2
CS0  (via drill 0.33)
  Top 0.152: v8.99,24.11 8.99,24.31 8.43,24.87 8.43,25.65 U003.45
  Bottom 0.152: v8.99,24.11 7.75,24.11 J701.2
EN  (via drill 0.33)
  Top 0.152: v14.07,9.42 15.24,9.42 S201.5
  Bottom 0.152: v14.07,9.42 13.69,9.42 13.16,9.96 12.5,9.96 U004.3
GND  (via drill 0.33)
  other vias: 5.36,9.5 11.43,10.64 11.43,6.17 13.74,5.16 5.33,32.84 5.74,35.94 6.93,37.03 18.75,22.81 13.36,40.46 19.33,15.9 3.45,31.06 8.33,12.57 11.43,6.17 13.74,5.16 26.37,24.13 5.33,32.84 5.74,35.94 6.93,37.03 18.75,22.81 13.36,40.46 19.18,15.75 3.45,31.06
  pour Top (no thermals): 2.54,45.72 63.5,45.72 arc-90 66.04,43.18 66.04,2.54 arc-90 63.5,0 2.54,0 arc-90 0,2.54 0,43.18 arc-90
  pour Bottom (no thermals): 2.54,45.72 63.5,45.72 arc-90 66.04,43.18 66.04,2.54 arc-90 63.5,0 2.54,0 arc-90 0,2.54 0,43.18 arc-90
  pour Top (no thermals): 2.54,45.72 30.48,45.72 30.48,0 2.54,0 arc-90 0,2.54 0,43.18 arc-90
  pour Bottom (no thermals): 2.54,45.72 30.48,45.72 30.48,0 2.54,0 arc-90 0,2.54 0,43.18 arc-90
M1-
  pour Top (no thermals): 45.97,45.72 45.97,43.69 54.86,43.69 54.86,37.59 49.28,37.59 46.74,40.13 46.74,43.43 45.97,43.43 45.97,36.32 55.12,27.18 55.12,26.42 66.04,26.42 66.04,43.18 arc90 63.5,45.72
M2-
  pour Top (no thermals): 66.04,22.86 66.04,2.54 arc-90 63.5,0 46.74,0 46.74,1.78 54.86,1.78 54.86,8.13 49.28,8.13 46.48,5.33 46.48,0 33.02,0 33.02,5.59 44.45,5.59 48.51,9.65 50.29,9.65 50.29,22.86
MISO0  (via drill 0.33)
  Top 0.152: v10.36,20.22 12.45,22.3 16.26,22.3 U003.29
  Bottom 0.152: v10.36,20.22 8.76,18.62 7.34,18.62 J701.7
MOSI0  (via drill 0.33)
  Top 0.152: v11.76,22.99 15.32,22.99 15.47,22.84 16.26,22.84 U003.30
  Bottom 0.152: v11.76,22.99 7.34,22.99 J701.3
MT+  (via drill 0.33)  (1 unrouted)
  Top 2.286: MT.1 v34.37,39.37 D204.4
  Bottom 2.286: v34.37,39.37 36.83,39.37 36.83,31.5 41.91,26.42 41.91,24.07 U201.13
MT-  (via drill 0.33)  (1 unrouted)
  Top 2.286: MT.2 v34.29,36.78 D205.4
  Bottom 2.286: v34.29,36.78 34.29,30.27 U201.14
MT_DIR  (via drill 0.33)  (1 unrouted)
  Top 0.152: v12.37,27.05 12.83,27.05 13.31,26.57 13.31,25.78 U003.35 | v25.15,32.41 25.43,32.13 25.43,20.45 26.19,19.68
  Bottom 0.152: v12.37,27.05 12.37,36.02 13.46,36.02 13.74,36.3 13.74,40.01 17.55,40.01 v25.15,32.41
MT_DIR_G
  Top 0.152: U$5.7 35.94,20.95 36.64,20.26 U201.10 | U201.7 48.26,16.45 48.26,13.97 U203.2
  Bottom 0.152: U201.10 43.03,16.45 U201.7
N$1
  Top 0.152: R202.1 47.61,10.41 D203.A
N$2  (1 unrouted)
  Top 0.152: U203.4 45.31,14.92 U201.5
N$12
  Top 0.152: U601.20 13.41,37.36 14.63,37.36 14.73,37.47 C620.2
N$13
  Top 0.152: U601.10 7.98,37.85 7.87,37.74 C610.1
N$14
  Top 0.152: S457.P$1 S457A.2
N$15
  Bottom 0.152: R301.2 13.97,13.82 12.78,13.82 12.5,13.54 U301.5
N$16  (via drill 0.33)
  Top 0.152: v6.88,6.63 9.12,8.87 9.12,9.65 D050.C
  Bottom 0.152: v6.88,6.63 7.11,6.86 7.57,6.86 R053.8
N$17
  Bottom 0.152: C001.1 7.37,10.44 9.09,12.17 9.09,12.27 9.25,12.42 10.52,12.42 10.67,12.27 10.67,10.59 10.06,9.98 9.88,9.98 U004.4
N$18  (via drill 0.33)
  Top 0.152: v10.03,10.77 10.03,10.69 9.63,10.29 8.28,10.29 7.64,10.92 D301.A
  Bottom 0.152: v10.03,10.77 9.5,10.77 9.09,10.36 9.09,9.58 9.17,9.5 R053.4
N$19  (via drill 0.33)
  Top 0.152: D301.C 9.37,10.92 9.93,11.48 v11.25,11.48
  Bottom 0.152: v11.25,11.48 11.25,12.14 9.88,13.51 U301.1
N$20  (via drill 0.33)
  Top 0.152: D050.A 7.01,9.04 v7.01,8.53 6.96,8.48 4.37,8.48 3.15,7.26 v3.15,6.45
  Bottom 0.152: v7.01,8.53 7.01,7.64 7.29,7.37 7.87,7.37 8.13,7.62 8.13,7.85 R053.2 | v3.15,6.45 3.15,7.37 Q050.3
PGND  (via drill 0.33, 0.76)  (4 unrouted)
  Top 0.152: U201.15 44.3,29.21 C219.2 | U201.1 44.3,6.35 C214.2
  Top 1.524: 53.59,6.35 v52.83,6.35 | U201.15 44.3,31.73 D205.1 | D204.1 43.18,39.73 v43.18,38.35 | U204.2 U204.4 v47.5,19.76
  other vias: 49.78,38.35 50.8,38.35 51.82,38.35 52.83,38.35 53.85,38.35 49.78,7.37 50.8,7.37 51.82,7.37 52.83,7.37 53.85,7.37 49.78,6.35 50.8,6.35 51.82,6.35 53.85,6.35 49.78,5.33 50.8,5.33 51.82,5.33 52.83,5.33 53.85,5.33 49.78,39.37 50.8,39.37 51.82,39.37 52.83,39.37 53.85,39.37 49.78,40.39 50.8,40.39 51.82,40.39 52.83,40.39 53.85,40.39
  pour Top (no thermals): 49.53,43.18 54.1,43.18 54.1,38.1 49.53,38.1
  pour Top (no thermals): 49.53,2.54 49.53,7.62 54.36,7.62 54.36,2.54
  pour Bottom (no thermals): 33.02,45.72 63.5,45.72 arc-90 66.04,43.18 66.04,2.54 arc-90 63.5,0 33.02,0
PVCC  (3 unrouted)
  Top 0.152: U203.5 48.26,13.02 48.26,11.68 R202.2 | U204.3 49.76,24.45 U201.9
PWMB  (via drill 0.33)  (1 unrouted)
  Top 0.152: R402.8 15.24,25.6 15.21,25.58 15.21,23.57 15.47,23.32 16.26,23.32 U003.31 16.33,23.29 17.58,23.29 v17.58,22 | 27.86,20.42 v26.26,20.42
  Bottom 0.152: v17.58,22 19.15,20.42 v26.26,20.42
PWMB_G
  Top 0.152: U$5.6 34.72,19.68 U201.6 41.91,17.87 41.91,19.14 U201.11
PWMG  (via drill 0.33)
  Top 0.152: R402.5 15.24,27.2 13.92,27.2 U003.34 13.89,25.6 v13.89,23.57 | v26.36,25.4 27,24.77 U$3.3
  Bottom 0.152: v13.89,23.57 13.89,18.82 13.87,18.8 13.87,17.25 16.76,17.25 16.84,17.17 20.04,17.17 20.75,17.88 24.54,17.88 26.95,20.3 26.95,25.4 v26.36,25.4
PWMG_G  (via drill 0.33)
  Top 0.152: U$3.6 v35.43,24.77 | Q202.G v48.7,6.6
  Bottom 0.152: v35.43,24.77 37.08,23.11 37.08,6.6 v48.7,6.6
PWMR  (via drill 0.33)
  Top 0.152: U003.33 14.42,26.17 R402.7 15.32,26.19 15.75,26.19 15.75,27.51 16.15,27.91 v16.26,27.91 | v26.36,26.67 27,26.04 U$3.2
  Bottom 0.152: v16.26,27.91 15.54,28.63 14.78,28.63 14.43,28.98 14.43,30.38 22.66,30.38 v26.36,26.67
PWMR_G  (via drill 0.33)
  Top 0.152: U$3.7 35.43,26.04 v41.15,31.75 | v48.7,39.3 Q201.G
  Bottom 0.152: v41.15,31.75 v48.7,39.3
QWMB
  Top 0.152: D001.1 16.36,25.73 R402.1
QWMG
  Top 0.152: D001.5 17.09,27.1 16.36,27.1 16.26,27.2 R402.4
QWMR
  Top 0.152: D001.3 16.74,26.42 16.51,26.19 16.26,26.19 R402.2
RESET  (via drill 0.33)
  Top 0.152: v17.78,29.21 R401.2 | v15.01,29.21 13.36,29.21 12.98,28.83 11.68,28.83 | S457A.1 11.68,29.91 11.68,28.83 | v6.25,25.98 6.25,20.22 5.87,19.84 5.08,19.84 U003.57 | 11.68,28.83 v11.18,28.83
  Bottom 0.152: v15.01,29.21 v17.78,29.21 | v6.25,25.98 6.78,25.98 9.63,28.83 v11.18,28.83
RX0
  Top 0.152: J401.3 18.34,18.34 16.28,18.34 U003.21
SCK0  (via drill 0.33)
  Top 0.152: v11.76,20.8 14.96,20.8 15.47,21.31 16.26,21.31 U003.27
  Bottom 0.152: v11.76,20.8 J701.5
SCL0  (via drill 0.33)
  Top 0.152: v15.47,38.84 13.41,38.84 U601.23 | v18.75,29.21 18.82,29.29 R401.4 | U003.22 16.26,18.82 14.71,18.82 v14.45,18.57 | v19.91,32.16 19.91,30.89 J401.6 | v18.54,37.08 U101.5 16.26,37.08 15.75,36.58 15.75,33.4 10.03,33.4 9.4,34.04 5.51,34.04 4.88,33.4 3.56,33.4 U902.14
  Bottom 0.152: J401.6 v18.75,29.21 16.69,27.15 16.69,24.59 14.96,22.86 14.96,19.07 v14.45,18.57 | v19.91,32.16 19.91,37.08 v18.54,37.08 17.22,37.08 v15.47,38.84
SDA0  (via drill 0.33)
  Top 0.152: R401.3 18.26,30 18.26,30.23 18.01,30.48 16.94,30.48 16.74,30.68 v16.74,31.65 16.74,32.82 | v14.33,39.42 14.28,39.37 13.41,39.37 U601.24 | U902.13 2.46,32.26 7.37,32.26 7.92,32.82 16.74,32.82 | v18.41,21.97 17.27,20.83 U003.26 | v19.91,23.16 19.91,30.45 19.33,31.04 19.33,32.38 19.68,32.74 20.6,32.74 J401.7 | U101.6 17.4,35.58 17.4,33.48 16.74,32.82
  Bottom 0.152: J401.7 21.41,31.57 19.68,31.57 19.61,31.65 v16.74,31.65 14.33,34.06 v14.33,39.42 | v18.41,21.97 18.72,21.97 v19.91,23.16
TX0
  Top 0.152: J401.2 19.86,17.32 U003.19
USB_ON  (via drill 0.33)
  Top 0.152: v6.73,5.77 8.28,5.77 9.83,4.22 14.58,4.22 18.31,7.95 18.31,9.93 19.79,11.4 19.79,14.12 v17.58,16.33 | v8.59,16.94 8.23,16.94 5.87,19.3 5.08,19.3 U003.58 | S458.P$2 13.28,29.97 v13.44,30.12
  Bottom 0.152: v6.73,5.77 4.65,7.85 R015.2 | v17.58,16.33 15.34,16.33 14.73,16.94 12.95,16.94 | v8.59,16.94 12.95,16.94 | v13.44,30.12 13.44,29.74 12.95,29.26 12.95,16.94
USB_SOFTCONNECT  (via drill 0.33)
  Top 0.152: v11.99,16.36 12.01,16.33 16.26,16.33 U003.17 | v1.35,9.22 1.35,7.98 0.76,7.39 0.76,5.26 v1.02,5.26
  Bottom 0.152: R015.4 3.99,6.86 3.99,6.48 3.38,5.87 1.57,5.87 1.04,6.4 Q050.1 1.29,6.04 1.29,5.26 v1.02,5.26 | v11.99,16.36 8.48,16.36 v1.35,9.22
USBD+  (via drill 0.33)
  Top 0.152: v13.44,8.87 13.44,11.96 v13.89,12.42 | v12.17,12.75 12.17,12.93 11.43,13.66 11.43,14.45 U003.10
  Bottom 0.152: R023.3 10.11,7.85 10.11,7.75 10.49,7.37 12.12,7.37 12.5,7.75 12.5,7.85 C023.2 12.55,7.92 12.55,7.98 v13.44,8.87 | v13.89,12.42 12.5,12.42 v12.17,12.75
USBD-  (via drill 0.33)
  Top 0.152: v11.43,9.8 12.19,10.57 12.19,11.96 12.75,12.52 12.75,12.98 12.29,13.44 12.17,13.44 11.94,13.66 11.94,14.45 U003.11
  Bottom 0.152: 11.43,7.85 11.86,7.85 C023.1 | 11.43,7.85 10.74,7.85 R023.4 | v11.43,9.8 11.43,7.85
VBUS
  Bottom 0.152: 7.7,5.18 6.5,5.18 4.83,6.86 4.65,6.86 R015.3 | 7.7,5.18 9.17,6.66 9.17,6.86 R053.5 | 7.7,5.18 7.75,5.13 7.75,3.48 8.43,2.79 12.01,2.79 12.7,3.48 12.7,4.04 J004.1 12.75,4.12 12.75,4.98 13.97,6.2 R011.2 14.02,6.76 15.16,6.76 20.04,11.63 20.04,13.77 C302.1 20.07,13.99 20.75,14.68 20.75,16.46 J401.1 19.13,16.51 18.06,15.44 17.27,15.44 D302.1 17.2,15.47 16.94,15.72 13.44,15.72 13.16,15.44 12.5,15.44 U301.4
VCC  (via drill 0.33)
  Top 0.152: v8.18,8.74 5.03,5.59 2.85,5.59 1.93,6.5 | 1.8,6.63 1.93,6.5 | v1.98,7.95 1.98,6.55 1.93,6.5 | 5.05,22.81 U003.51 2.94,22.82 C451.1 2.94,22.62 v3.76,21.79 | C463.1 | 9.53,15.65 9.14,16.03 6.12,16.03 5.84,15.75 5.08,15.75 | 9.53,15.65 9.91,15.27 9.91,14.48 U003.7 | 9.58,19.3 9.58,15.7 9.53,15.65 | 9.58,19.3 9.58,21.89 | 9.58,21.89 9.58,24.33 9.45,24.46 9.45,25.6 U003.43 9.42,27.43 C443.1 | v9.53,21.89 9.58,21.89 | v6.48,13.21 5.77,13.92 C463.1 | R401.8 17.25,30.96 17.78,30.96 R401.7 17.86,30.96 18.26,30.96 R401.6 18.34,30.96 18.82,30.96 R401.5 | D001.6 17.93,27.08 17.93,26.42 D001.4 17.93,26.36 17.93,25.76 D001.2 | 17.91,25.68 D001.2 | R401.5 18.85,31.04 18.85,33.27 20.57,33.27 J401.8 | 19.33,24.41 19.33,30.45 18.87,30.91 R401.5 | 19.33,24.41 19.33,20.62 18.31,19.61 18.31,19.48 C423.1 18.29,19.41 16.36,19.41 U003.23 16.27,19.3 9.58,19.3 | 8.64,38.86 6.45,38.86 C906.1 | 8.64,38.86 9.45,38.86 U601.8 | 10.19,35.23 10.19,34.62 C613.2 | 10.19,35.23 U601.13 | C901.1 6.35,34.87 4.7,34.87 4.67,34.85 U902.1 | C901.1 6.4,34.92 6.71,35.23 10.19,35.23 | 21.59,37.85 C101.1 | U902.7 3.56,38.91 4.65,38.91 U902.6 | U902.6 | 21.64,37.8 C101.1 | 19.33,24.41 17.95,24.41 D001.2 | U601.3 11.68,43.43 | 8.64,38.86 8.64,43.43 11.68,43.43 | C906.1 | C906.1 C901.1 | 5.08,15.75 4.06,15.75 3.81,16 3.81,16.82 U003.63 | C463.1 5.08,13.97 5.08,15.75 | J401.8 21.59,34.04 22.28,34.72 22.28,37.08 21.59,37.08 | 21.59,37.08 U101.2 U101.3 19.99,39.62 17.02,39.62 17.02,43.43 11.68,43.43 | C101.1 21.59,37.08 | C906.1 4.65,38.96 U902.6 | U$5.1 27.13,22.96 25.78,22.96 25.78,26.9 26.19,27.3 | U$3.1 26.19,27.3 | 26.19,27.3 25.73,27.76 25.73,32.64 23.7,34.67 22.33,34.67 J401.8
  Bottom 0.152: 1.98,8.31 1.04,8.31 Q050.2 | 1.98,8.31 2.9,8.31 | 2.9,8.31 3.38,8.31 3.81,7.87 R015.1 | 2.9,8.31 2.9,8.36 6.1,11.56 C003.1 6.12,11.63 6.12,12.85 v6.48,13.21 | v8.18,8.74 8.18,9.88 9.86,11.56 9.86,11.86 U004.5 | v1.98,7.95 1.98,8.31 | v3.76,21.79 3.86,21.89 7.11,21.89 J701.4 7.19,21.89 v9.53,21.89
VDD  (2 unrouted)
  Top 0.152: U$3.8 34.67,27.3 40.13,32.77 40.13,36.35
  Top 1.524: D204.3 40.13,44.35 40.13,36.35 D205.3 46.97,36.35 54.38,28.93 U204.1 63.75,25.96 BAT.1 | 63.75,36.35 63.75,34.8
  Top 2.286: M1.1 63.75,39.75 | 63.75,39.75 63.75,34.8 BAT.1 63.75,5.97 | D201.C 63.75,39.75 | 63.75,5.97 M2.1 | D202.C 63.75,5.97
VIN  (via drill 0.33)
  Top 0.152: v15.65,12.34 16.54,13.23 S201.6
  Bottom 0.152: 14.66,12.34 14.66,12.27 13.97,11.58 C204.1 13.92,11.58 13.64,11.86 12.5,11.86 U004.1 | 14.66,12.34 14.66,13.56 15.14,14.05 15.14,14.48 D302.3 | 14.66,12.34 v15.65,12.34
VLIPO  (via drill 0.33)
  Top 0.152: J301.2 10.44,7.9 12.5,9.96 12.5,11.84 13.66,13.01 14.68,13.01 15.16,13.49 v15.39,13.49 15.95,14.05 17.14,14.05 17.25,13.95 17.78,13.95 18.14,14.3 18.14,14.76 17.12,15.77 v11.38,15.77 11.4,15.82 11.4,16.59 v12.34,17.53 | v8.59,26.98 7.95,27.61 6.6,27.61 5.37,26.38 5.37,23.82 U003.49 2.94,23.82 C449.2
  Bottom 0.152: C301.1 9.58,15.14 9.86,15.42 U301.3 9.93,15.47 11.07,15.47 v11.38,15.77 | R302.2 17.8,13.97 17.37,13.54 17.27,13.54 D302.2 17.2,13.49 v15.39,13.49 | v8.59,26.98 12.34,23.22 v12.34,17.53
XTAL1
  Top 0.152: 3,15.44 C462.2 2.95,16.92 Y401.1 3.02,16.94 3.38,17.3 5.05,17.3 U003.62
XTAL2
  Top 0.152: C461.2 1.65,20.07 1.65,18.64 Y401.3 1.68,18.57 1.68,18.47 2.36,17.78 3.53,17.78 3.56,17.8 5.05,17.8 U003.61

### Text on the board
tPlace: HighAcc | Baro | -M1+ | 9DoF | 3V3 | SDA | SCL | BSL | Reset | Boot | GND | RX0 | TX0 | -BAT+ | VBUS | Charge | USB | On | -M2+
bPlace: 3V3 | SDA | SCL | BSL | GND | RX0 | TX0 | stkwans.blogspot.com | a division of Kwan Systems | the terminally ADD | St Kwan's Home for | past this point! | Project Arisa | VBUS | No electrons permitted | 1 Apr 2014 | LPC2148 Engine Room | v1.0 01 Apr 2014